# EAGLE design Shawn'sNano (EAGLE 8.7.1)
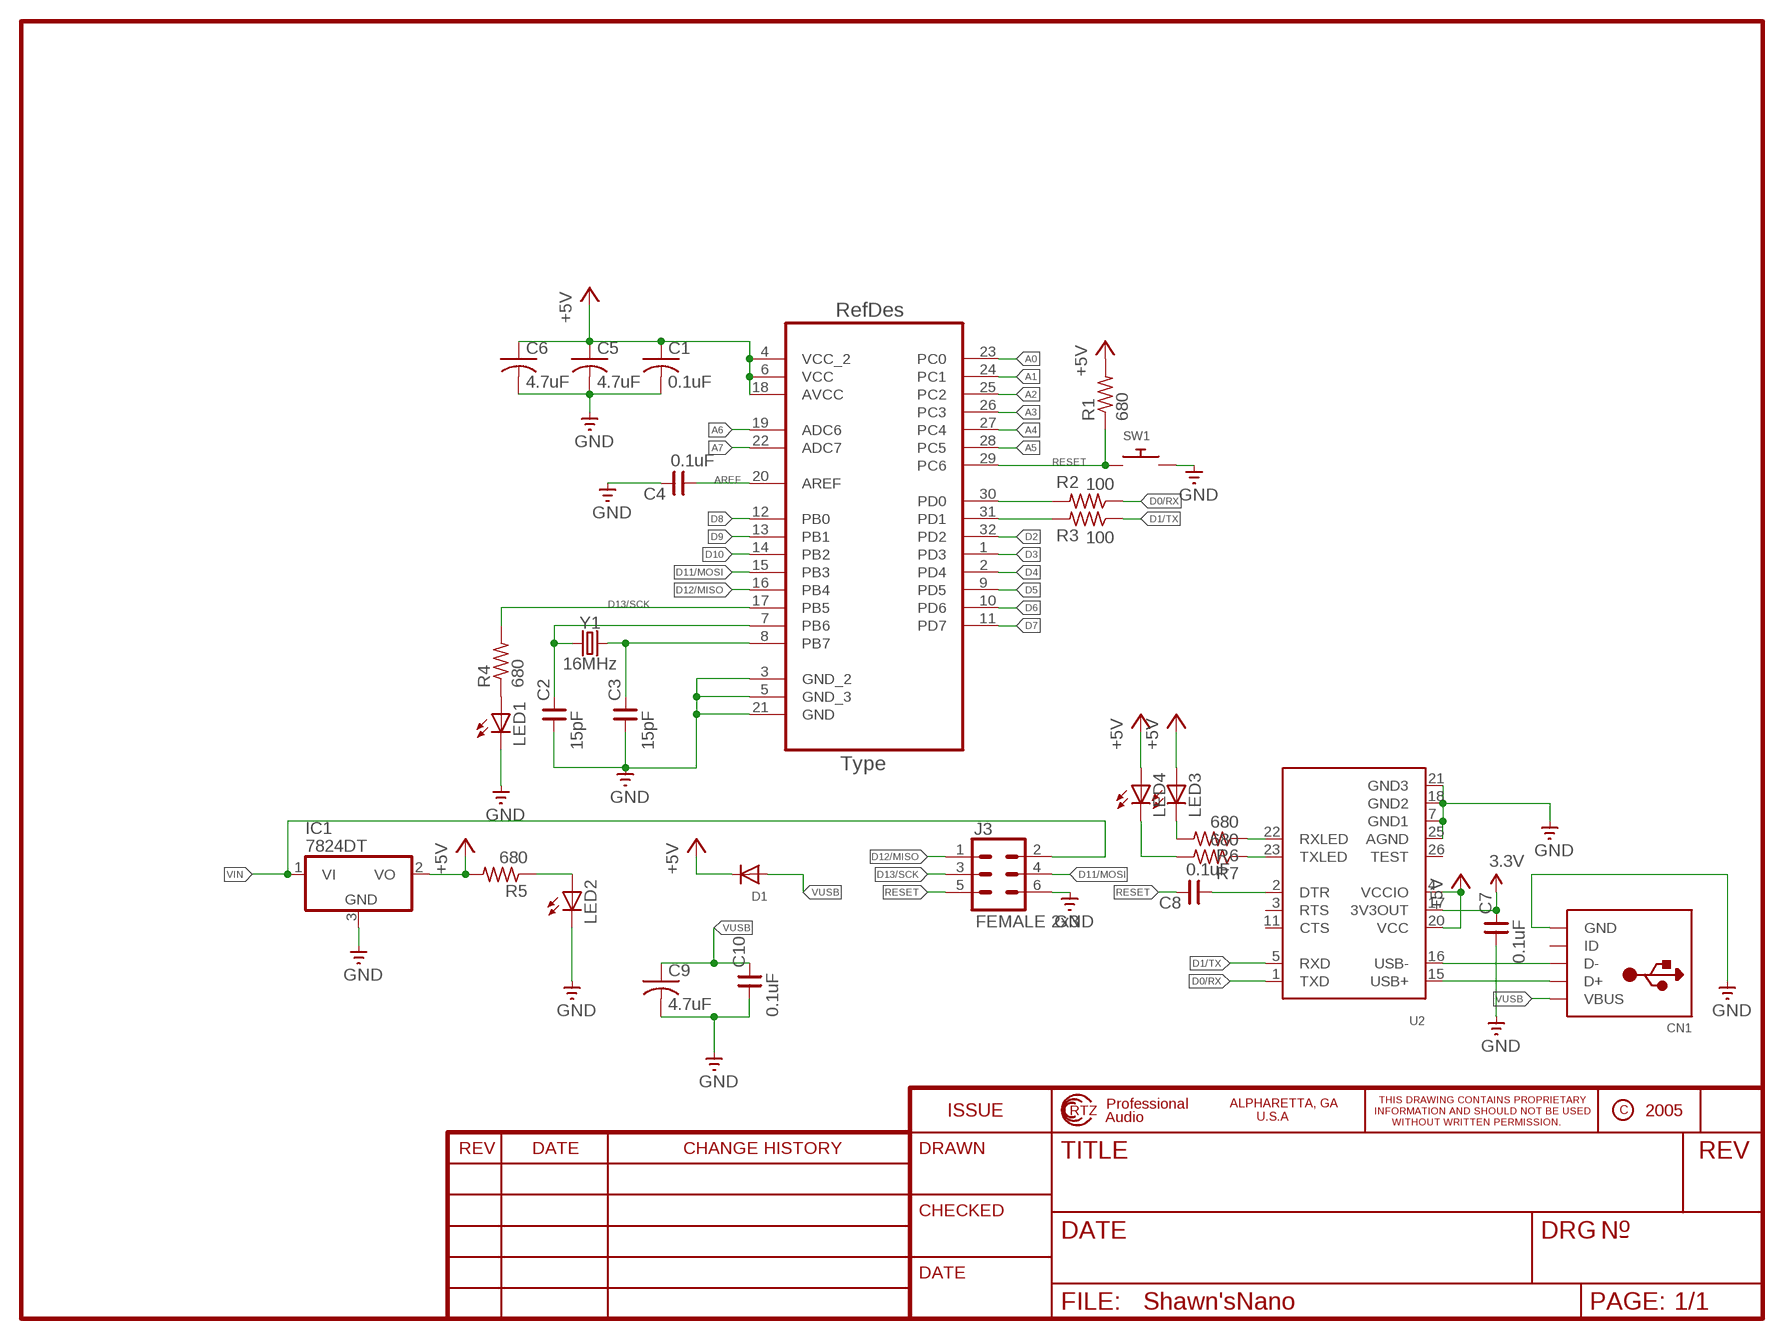
[diagram p0: schematic, sheet 1]

## Parts
C1  0.1uF  C-USC0805  [C0805]
C2  15pF  CNP-0805  [0805]
C3  15pF  CNP-0805  [0805]
C4  0.1uF  CNP-0805  [0805]
C5  4.7uF  C-USC0805  [C0805]
C6  4.7uF  C-USC0805  [C0805]
C7  0.1uF  CNP-0805  [0805]
C8  0.1uF  CNP-0805  [0805]
C9  4.7uF  C-USC0805  [C0805]
C10  0.1uF  CNP-0805  [0805]
CN1  USBMINIB  [USB-MINIB]
D1  DIODESOD-123  [SOD-123]
IC1  7824DT  [TO252]
J3  FEMALE 2x3  CONN_03X2FEMALE  [2X3]
LED1  LEDCHIPLED_0805  [CHIPLED_0805]
LED2  LEDCHIPLED_0805  [CHIPLED_0805]
LED3  LEDCHIPLED_0805  [CHIPLED_0805]
LED4  LEDCHIPLED_0805  [CHIPLED_0805]
R1  680  R-US_R0805  [R0805]
R2  100  R-US_R0805  [R0805]
R3  100  R-US_R0805  [R0805]
R4  680  R-US_R0805  [R0805]
R5  680  R-US_R0805  [R0805]
R6  680  R-US_R0805  [R0805]
R7  680  R-US_R0805  [R0805]
SW1  SWITCH_PUSHBUTTONEVQ-PE  [TACT_PANA-EVQ]
U1  ATMEGA328P-AU  [QFP80P900X900X120-32N]
U2  FT232RLSSOP28  [SSOP28DB]
Y1  16MHz  CRYSTAL-16MHZPTH-HC49US  [HC49US]

## Nets
3.3V: C7.2 U2.17(3V3OUT)
+5V: C1.1 C5.1 C6.1 D1.C IC1.2(VO) LED3.A LED4.A R1.2 R5.2 U1.4(VCC_2) U1.6(VCC) U1.18(AVCC) U2.4(VCCIO) U2.20(VCC)
A0: U1.23(PC0)
A1: U1.24(PC1)
A2: U1.25(PC2)
A3: U1.26(PC3)
A4: U1.27(PC4)
A5: U1.28(PC5)
A6: U1.19(ADC6)
A7: U1.22(ADC7)
AREF: C4.1 U1.20(AREF)
D0/RX: R2.1 U2.1(TXD)
D1/TX: R3.1 U2.5(RXD)
D2: U1.32(PD2)
D3: U1.1(PD3)
D4: U1.2(PD4)
D5: U1.9(PD5)
D6: U1.10(PD6)
D7: U1.11(PD7)
D8: U1.12(PB0)
D9: U1.13(PB1)
D10: U1.14(PB2)
D11/MOSI: J3.4 U1.15(PB3)
D12/MISO: J3.1 U1.16(PB4)
D13/SCK: J3.3 R4.2 U1.17(PB5)
GND: C1.2 C2.1 C3.1 C4.2 C5.2 C6.2 C7.1 C9.2 C10.1 CN1.GND IC1.3(GND) J3.6 LED1.C LED2.C SW1.P$2 U1.3(GND_2) U1.5(GND_3) U1.21(GND) U2.7(GND1) U2.18(GND2) U2.21(GND3) U2.25(AGND)
N$1: C3.2 U1.8(PB7) Y1.2
N$2: C2.2 U1.7(PB6) Y1.1
N$3: LED1.A R4.1
N$4: LED2.A R5.1
N$5: CN1.D+ U2.15(USB+)
N$6: CN1.D- U2.16(USB-)
N$7: R2.2 U1.30(PD0)
N$8: R3.2 U1.31(PD1)
N$9: LED3.C R6.2
N$12: R6.1 U2.22(RXLED)
N$13: R7.1 U2.23(TXLED)
N$14: C8.1 U2.2(DTR)
N$15: LED4.C R7.2
RESET: C8.2 J3.5 R1.1 SW1.P$1 U1.29(PC6)
VIN: IC1.1(VI) J3.2
VUSB: C9.1 C10.2 CN1.VBUS D1.A
Unconnected: CN1.ID U2.3(RTS) U2.11(CTS) U2.26(TEST)

## Library data of the parts
C1 C5 C6 C9 = adafruit:C-US: CAPACITOR, American symbol
C2-C4 C7 C8 C10 = cap-master:CNP-: NON-POLARIZED CAP
CN1 = adafruit:USB: USB Connectors USBMINIB - Surface Mount Female Mini-B USB Connector 4UConnector: 06564 By microbuilder.eu Thru-hole RA Female Mini-B USB Connector 4UConnector: 18732 By ladyada.net
D1 = adafruit:DIODE: Diode SMADIODE - SMA Surface Mount Package 20V 1A Schottky Diode Digikey: 641-1014-6-ND DO-1N4148 - Through Hole Small Current Diode SOD-123 20V 1 A (.5mV Vf) Schottky Diode - Digikey: MBRX120TPMSCT-ND SOD-323 10V 570mA (.38mV Vf, 3ns) Schottky Diode - Digikey: ZLLS410CT-ND SOD-523 30V 30mA Schottky Diode (RB751S-40TE61) - Digikey: RB751S-40TE61CT-ND SOT23-R/W - SOT23 Package (R = Solder Paste/Reflow Ovens, W = Hand-Soldering) BAT54Film 40V 300mA - Digikey: 497-7162-1-ND
IC1 = adafruit:78*: Positive VOLTAGE REGULATOR Added bigger pads to the TO-92 package
J3 = SparkFun-Connectors:CONN_03X2: Multi connection point. Often used as Generic Header-pin footprint for 0.1 inch spaced/style header connections You can populate with any combo of single row headers, but if you'd like an exact match, check these: Header - 2x3 (Male, 0.1") <https://www.sparkfun.com/products/12807> (PRT-12807) Header - 2x3 (Female, 0.1") <https://www.sparkfun.com/products/13010> (PRT-13010) 2x3 Pin Shrouded Header <https://www.sparkfun.com/products/10877> (PRT-10877) On any of the 0.1 inch spaced packages, you can populate with these: Break Away Headers - Straight <https://www.sparkfun.com/products/116> (PRT-00116) Break Away Male Headers - Right Angle <https://www.sparkfun.com/products/553> (PRT-00553) Female Headers <https://www.sparkfun.com/products/115> (PRT-00115) Break Away Headers - Machine Pin <https://www.sparkfun.com/products/117> (PRT-00117) Break Away Female Headers - Swiss Machine Pin <https://www.sparkfun.com/products/743> (PRT-00743) Special note: the shrouded connector mates well with our 3x2 ribbon cables: Ribbon Crimp Connector - 6-pin (2x3, Female) <https://www.sparkfun.com/products/10651> (PRT-10651) Ribbon Cable - 6 wire (15ft) <https://www.sparkfun.com/products/10646> (PRT-10646); PROD_ID: CONN-11566
LED1-LED4 = adafruit:LED: LED OSRAM: - CHIPLED LG R971, LG N971, LY N971, LG Q971, LY Q971, LO R971, LY R971 LH N974, LH R974 LS Q976, LO Q976, LY Q976 LO Q996 - Hyper CHIPLED LW Q18S LB Q993, LB Q99A, LB R99A - SideLED LS A670, LO A670, LY A670, LG A670, LP A670 LB A673, LV A673, LT A673, LW A673 LH A674 LY A675 LS A676, LA A676, LO A676, LY A676, LW A676 LS A679, LY A679, LG A679 - Hyper Micro SIDELED® LS Y876, LA Y876, LO Y876, LY Y876 LT Y87S - SmartLED LW L88C, LW L88S LB L89C, LB L89S, LG L890 LS L89K, LO L89K, LY L89K LS L896, LA L896, LO L896, LY L896 - TOPLED LS T670, LO T670, LY T670, LG T670, LP T670 LSG T670, LSP T670, LSY T670, LOP T670, LYG T670 LG T671, LOG T671, LSG T671 LB T673, LV T673, LT T673, LW T673 LH T674 LS T676, LA T676, LO T676, LY T676, LB T676, LH T676, LSB T676, LW T676 LB T67C, LV T67C, LT T67C, LS T67K, LO T67K, LY T67K, LW E67C LS E67B, LA E67B, LO E67B, LY E67B, LB E67C, LV E67C, LT E67C LW T67C LS T679, LY T679, LG T679 LS T770, LO T770, LY T770, LG T770, LP T770 LB T773, LV T773, LT T773, LW T773 LH T774 LS E675, LA E675, LY E675, LS T675 LS T776, LA T776, LO T776, LY T776, LB T776 LHGB T686 LT T68C, LB T68C - Hyper Mini TOPLED® LB M676 - Mini TOPLED Santana® LG M470 LS M47K, LO M47K, LY M47K Source: http://www.osram.convergy.de/
R1-R7 = adafruit:R-US_: RESISTOR, American symbol
SW1 = adafruit:SWITCH_PUSHBUTTON: Buttons SOFTTOUCHSMD_SJ - Soft touch temporary push button (Super Junk Akihabara) Compatible with SKPMANE010 [Mouser: 688-SKPMAN] C&K_KSS = Digikey: KSS221GLFS
U1 = Atmel-ATMEGA328P-AU:ATMEGA328P-AU; DESCRIPTION: 8-bit Microcontroller with In-System Programmable Flash; MPN: ATMEGA328P-AU; OC_FARNELL: 1715486; OC_NEWARK: 14R4631; PACKAGE: TQFP-32; SUPPLIER: Atmel
U2 = microbuilder:FT232RL: FTDI FT232RL USB TO RS232 Converter Digikey: 768-1007-1-ND
Y1 = SparkFun-Clocks:CRYSTAL-16MHZ: 16MHz Crystal Digikey Example <http://www.digikey.com/product-search/en?keywords=535-9122-1-ND> Frequency: 16MHz Frequency Stability: ±50ppm Frequency Tolerance: ±20ppm Load Capacitance: 18pF SparkFun Products: Pro Micro -5V/16MHz <https://www.sparkfun.com/products/12640> SparkFun Serial Enabled LCD Kit <https://www.sparkfun.com/products/10097>; PROD_ID: XTAL-08181; SF_ID: COM-00536

## Board
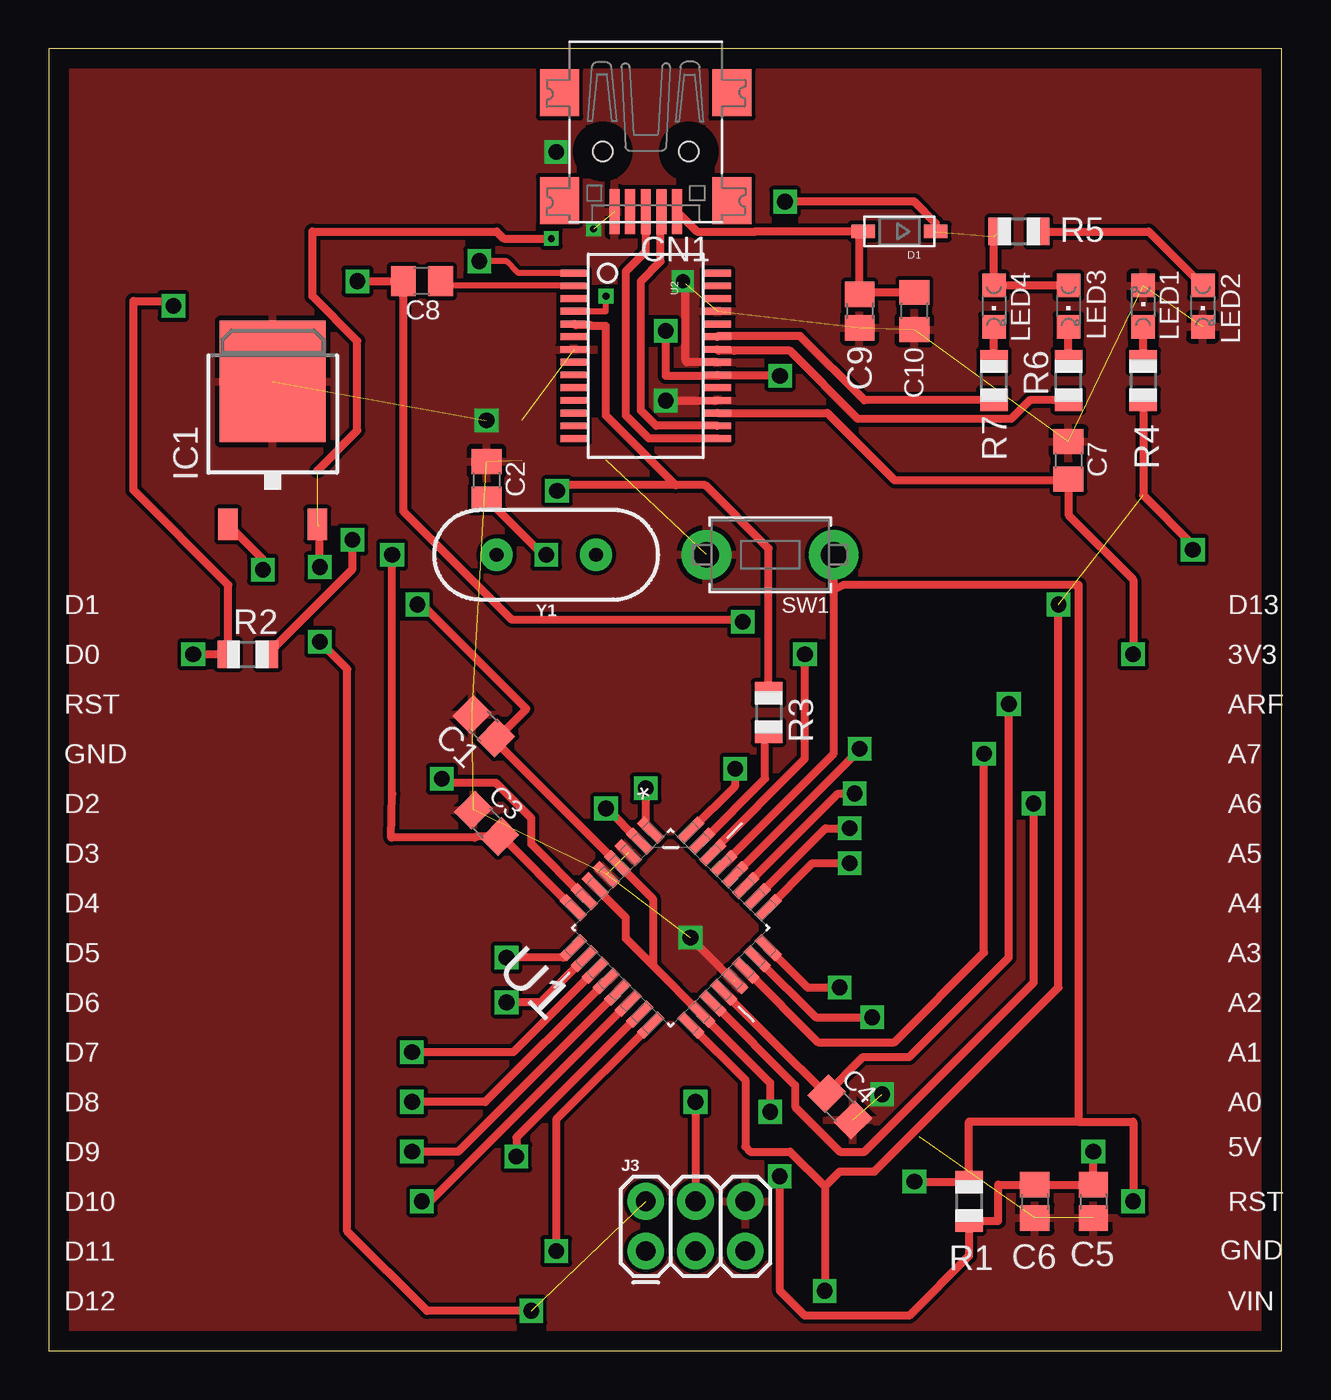
[diagram p1: board, top side]
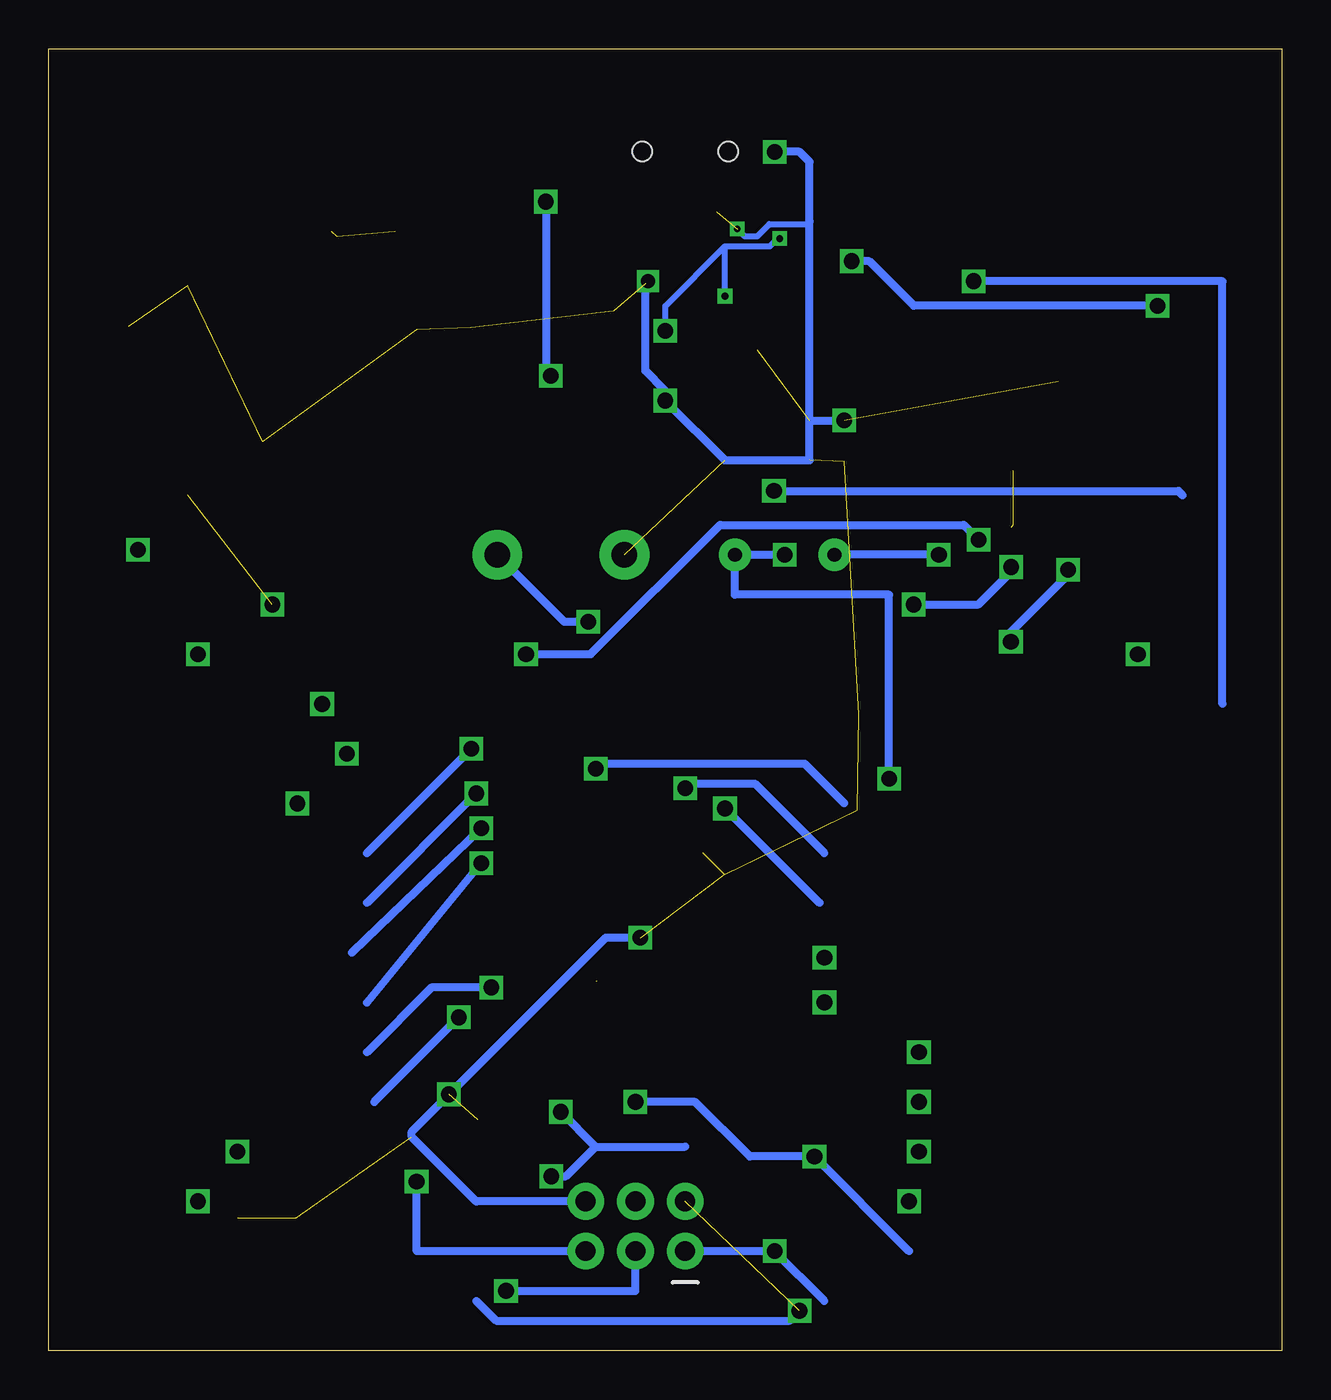
[diagram p2: board, bottom side, seen from below]

Size 62.97 x 66.47 mm. Coordinates in mm from the lower left corner, seen from the top.
Outline: 0,0 62.97,0 62.97,66.47 0,66.47 0,0
Copper layers (1*16): Top 0.035mm / dielectric 1.5mm / Bottom 0.035mm
Design rules "default": minimum track width 10mil, minimum drill 24mil, track to track 8mil, track to pad 8mil, pad to pad 8mil, via to via 8mil, smd to smd 8mil, copper to edge 40mil, drill to drill 8mil, minimum pad ring 10mil, minimum via ring 8mil, stop-mask expansion 4mil, vias tented up to drill 0mil, thermal gap 10mil

### Footprints (pad centres in the part's own frame; a part is rotated, then mirrored left to right if it is on the bottom)
C0805 = smd 1.3 x 1.5: 1 -0.85,0; 2 0.85,0
0805 = smd 1.27 x 1.524: 1 -0.953,0; 2 0.953,0
USB-MINIB = smd 0.5 x 2.308: D+ 0,4.064; D- -0.8,4.064; GND 1.6,4.064; ID 0.8,4.064; VBUS -1.6,4.064 | smd 2 x 2.4: GND1 -4.4,-2; GND2 -4.4,3.5; GND3 4.4,3.5; GND4 4.4,-2 | hole 1: -2.2,1; 2.2,1
SOD-123 = smd 1.2 x 0.7: A 1.85,0; C -1.85,0
TO252 = smd 1 x 1.6: 1 -2.28,-4.8; 2 2.28,-4.8 | smd 5.4 x 6.2: 3 0,2.5
2X3 = drill 1.016 pad 1.88: 1 0,0; 2 0,2.54; 3 2.54,0; 4 2.54,2.54; 5 5.08,0; 6 5.08,2.54
CHIPLED_0805 = smd 1.2 x 1.2: A 0,-1.05; C 0,1.05
R0805 = smd 1.1 x 1.4: 1 -1,0; 2 1,0
TACT_PANA-EVQ = drill 1.3 pad 2.54: P$1 -3.25,0; P$2 3.25,0
QFP80P900X900X120-32N = smd 1.473 x 0.508: 1 -4.242,2.794; 2 -4.242,2.007; 3 -4.242,1.194; 4 -4.242,0.406; 5 -4.242,-0.406; 6 -4.242,-1.194; 7 -4.242,-2.007; 8 -4.242,-2.794; 17 4.242,-2.794; 18 4.242,-2.007; 19 4.242,-1.194; 20 4.242,-0.406; 21 4.242,0.406; 22 4.242,1.194; 23 4.242,2.007; 24 4.242,2.794 | smd 0.508 x 1.473: 9 -2.794,-4.242; 10 -2.007,-4.242; 11 -1.194,-4.242; 12 -0.406,-4.242; 13 0.406,-4.242; 14 1.194,-4.242; 15 2.007,-4.242; 16 2.794,-4.242; 25 2.794,4.242; 26 2.007,4.242; 27 1.194,4.242; 28 0.406,4.242; 29 -0.406,4.242; 30 -1.194,4.242; 31 -2.007,4.242; 32 -2.794,4.242
SSOP28DB = smd 0.348 x 1.397: 1 -4.225,-3.656; 2 -3.575,-3.656; 3 -2.925,-3.656; 4 -2.275,-3.656; 5 -1.625,-3.656; 6 -0.975,-3.656; 7 -0.325,-3.656; 8 0.325,-3.656; 9 0.975,-3.656; 10 1.625,-3.656; 11 2.275,-3.656; 12 2.925,-3.656; 13 3.575,-3.656; 14 4.225,-3.656; 15 4.225,3.656; 16 3.575,3.656; 17 2.925,3.656; 18 2.275,3.656; 19 1.625,3.656; 20 0.975,3.656; 21 0.325,3.656; 22 -0.325,3.656; 23 -0.975,3.656; 24 -1.625,3.656; 25 -2.275,3.656; 26 -2.925,3.656; 27 -3.575,3.656; 28 -4.225,3.656
HC49US = drill 0.7 pad 1.651: 1 -2.54,0; 2 2.54,0

### Placement (x,y rotation side)
C1  22.22,31.89 135 top
C2  22.35,44.45 270 top
C3  22.35,26.92 315 top
C4  40.39,12.45 315 top
C5  53.34,7.62 270 top
C6  50.34,7.62 270 top
C7  52.07,45.47 270 top
C8  19.05,54.61 180 top
C9  41.4,53.09 270 top
C10  44.2,53.09 90 top
CN1  30.48,62.23 180 top
D1  43.43,57.15 180 top
IC1  11.43,46.99 0 top
J3  30.48,5.08 0 top
LED1  55.88,53.34 0 top
LED2  58.93,53.34 180 top
LED3  52.07,53.34 180 top
LED4  48.26,53.34 180 top
R1  46.99,7.62 270 top
R2  10.16,35.56 0 top
R3  36.76,32.59 270 top
R4  55.88,49.53 270 top
R5  49.53,57.15 180 top
R6  52.07,49.53 90 top
R7  48.26,49.53 90 top
SW1  36.83,40.64 180 top
U1  31.75,21.59 315 top
U2  30.48,50.8 270 top
Y1  25.4,40.64 180 top

### Tracks (layer width: path | path; a pad name or v marks a point on that pad's centre or on a via)
3.3V  (via drill 0.8)
  Top 0.406: U2.17 39.76,47.87 43.18,44.45 52.01,44.45 C7.2 52.07,42.67 55.37,39.37 v55.37,35.56
+5V  (via drill 0.35, 0.8)  (4 unrouted)
  Top 0.305: U2.4 28.44,53.07 28.45,53.09 v28.45,53.85
  Top 0.406: 30.84,19.66 U1.18 36.83,13.67 v36.83,12.19 | 30.84,19.66 29.46,21.04 29.46,22.1 27.91,23.66 U1.6 | 30.84,19.66 30.84,23.08 U1.4 22.82,31.1 C1.1 22.9,31.28 24.38,32.77 19.05,38.1 v18.81,38.1 | v53.34,10.16 C5.1 C6.1 48.48,8.47 48.48,6.62 R1.2 | 47.01,6.6 R1.2 | R1.2 46.72,6.35 | R1.2 46.99,4.83 43.94,1.78 38.61,1.78 37.34,3.05 37.34,8.91 v37.32,8.9 | v13.83,40.01 13.83,42.07 | LED3.A LED4.A 48.26,56.88 | D1.C 45.28,57.59 44.2,58.67 v37.59,58.67 | v37.34,49.78 34.18,49.78 U2.20 34.1,49.78 31.5,49.78 v31.5,52.07 | 13.71,44.95 15.75,46.99 15.75,51.56 13.46,53.85 13.46,57.15 22.86,57.15 23.22,56.79 v25.65,56.79
  Bottom 0.305: v31.5,52.07 31.5,53.34 28.45,56.39 | 28.45,56.39 26.16,56.39 25.76,56.79 v25.65,56.79 | v28.45,53.85 28.45,56.39
  Bottom 0.406: 35.05,10.41 v36.83,12.19 | 35.05,10.41 30.48,10.41 | v37.32,8.9 36.57,8.9 35.05,10.41 | v18.81,38.1 15.49,38.1 13.72,39.88 13.72,39.9 v13.83,40.01 | v37.59,58.67 37.59,49.78 v37.34,49.78
A0  (via drill 0.8)
  Top 0.406: U1.23 39.16,17.02 v42.05,17.02 42.16,17.02
  Bottom 0.406: v42.05,17.02 46.36,12.7
A1  (via drill 0.8)
  Top 0.406: U1.24 38.75,18.54 v40.39,18.54
  Bottom 0.406: v40.39,18.54 43.43,18.54 46.74,15.24
A2  (via drill 0.8)
  Top 0.406: U1.25 39,24.89 v40.89,24.89
  Bottom 0.406: v40.89,24.89 46.74,17.78
A3  (via drill 0.8)
  Top 0.406: U1.26 39.67,26.67 v40.89,26.67
  Bottom 0.406: v40.89,26.67 47.5,20.32
A4  (via drill 0.8)
  Top 0.406: U1.27 40.3,28.45 v41.15,28.45
  Bottom 0.406: v41.15,28.45 46.74,22.86
A5  (via drill 0.8)
  Top 0.406: U1.28 41.4,30.67 v41.4,30.73
  Bottom 0.406: v41.4,30.73 46.74,25.4
A6  (via drill 0.8)
  Top 0.406: U1.19 38.1,13.55 38.1,12.45 40.39,10.16 41.66,10.16 50.29,18.8 50.29,27.94 v50.28,27.94
A7  (via drill 0.8)
  Top 0.406: U1.22 39.28,15.75 43.18,15.75 47.75,20.32 v47.75,30.48
AREF  (via drill 0.8)
  Top 0.406: U1.20 37.87,14.9 C4.1 41.58,14.99 43.94,14.99 49.02,20.07 v49.02,33.02
D0/RX  (via drill 0.8)
  Top 0.305: U2.1 23.97,55.02 23.36,55.63 v21.98,55.63
  Top 0.406: v7.37,35.56 R2.1 9.16,39.1 4.32,43.94 4.32,53.59 6.11,53.59 v6.35,53.35
  Bottom 0.406: v6.35,53.35 18.81,53.35 21.08,55.63 v21.97,55.63 v21.98,55.63
D1/TX  (via drill 0.8)
  Top 0.406: R3.1 36.76,40.97 33.53,44.2 32,44.2 | 32,44.2 28.45,47.75 28.45,52.32 27.72,52.32 27.69,52.36 26.89,52.36 U2.5 | v25.95,43.9 26.25,44.2 32,44.2
  Bottom 0.406: v25.95,43.9 5.29,43.9 5.08,43.69
D2  (via drill 0.8)
  Top 0.406: U1.32 35.05,28.84 v35.05,29.72
  Bottom 0.406: v35.05,29.72 34.8,29.97 24.38,29.97 22.35,27.94
D3  (via drill 0.8)
  Top 0.406: U1.1 30.48,26.81 v30.48,28.71
  Bottom 0.406: v30.48,28.71 30.24,28.96 26.92,28.96 23.37,25.4
D4  (via drill 0.8)
  Top 0.406: U1.2 28.49,27.69 v28.45,27.69
  Bottom 0.406: v28.45,27.69 23.62,22.86
D5  (via drill 0.8)
  Top 0.406: U1.9 26.27,20.07 v23.37,20.07
  Bottom 0.406: v23.37,20.07 23.11,20.32
D6  (via drill 0.8)
  Top 0.406: U1.10 25.1,17.78 v23.37,17.78
D7  (via drill 0.8)
  Top 0.406: U1.11 23.71,15.24 v18.54,15.24
D8  (via drill 0.8)
  Top 0.406: U1.12 22.29,12.7 v18.54,12.7
D9  (via drill 0.8)
  Top 0.406: U1.13 20.89,10.16 v18.54,10.16
D10  (via drill 0.8)
  Top 0.406: U1.14 19.47,7.62 v19.05,7.62
D11/MOSI  (via drill 0.8)
  Top 0.406: U1.15 23.88,10.88 v23.88,9.91 | v33.02,12.7 J3.4
  Bottom 0.406: v33.02,12.7 29.97,12.7 27.18,9.91 v23.88,9.91 19.05,5.08
D12/MISO  (via drill 0.8)
  Top 0.406: U1.16 25.91,11.8 v25.91,5.08
  Bottom 0.406: J3.1 v25.91,5.08 23.37,2.54
D13/SCK  (via drill 0.8)  (1 unrouted)
  Top 0.406: U1.17 35.56,13.83 35.56,10.41 35.81,10.16 37.85,10.16 39.62,8.38 | 39.62,8.38 v39.62,3.05 | 39.62,8.38 40.39,9.14 42.16,9.14 51.56,18.54 v51.56,38.1 | R4.2 55.88,43.69 58.42,41.15 v58.42,40.89
  Bottom 0.406: v39.62,3.05 33.02,3.05 J3.3
GND  (via drill 0.35 pad 0.55, 0.7, 0.8)  (20 unrouted)
  Top 0.406: 34.97,18.88 v32.77,21.08 | U2.21 32.58,50.47 32.51,50.55 32.51,54.48 v32.38,54.61 | v31.5,48.52 34.13,48.52 U2.18
  Bottom 0.305: v27.82,57.28 27.44,56.9 26.81,56.9 26.18,57.53 24.26,57.53 24.13,57.66
  Bottom 0.406: J3.6 41.15,7.62 44.45,10.92 44.45,11.18 v42.55,13.08 | v42.55,13.08 42.42,13.21 | v32.77,21.08 34.54,21.08 v42.55,13.08 | v31.5,48.51 v31.5,48.52 | 24.13,47.5 24.13,57.66 24.13,60.71 24.64,61.21 v25.91,61.21 26.16,61.21 | 24.13,47.5 v22.35,47.5 | v31.5,48.52 31.5,49.02 32.51,50.04 32.51,54.48 v32.38,54.61 | v31.5,48.52 28.45,45.47 24.13,45.47 24.13,47.5
  pour Top: 0,0 0,66.29 62.99,66.55 62.99,0
N$1  (via drill 0.8)
  Top 0.406: U1.8 23.14,26.25 C3.2 21.8,26.25 21.76,26.2 17.48,26.2 17.53,28.45 v17.53,40.64
  Bottom 0.406: v17.53,40.64 Y1.2
N$2  (via drill 0.8)
  Top 0.406: U1.7 24.64,25.86 24.64,27.18 22.82,28.99 20.27,28.99 v20.07,29.2 | C2.2 25.21,40.64 v25.4,40.64
  Bottom 0.406: v20.07,29.2 20.07,38.61 27.94,38.61 Y1.1 v25.4,40.64
N$3
  Top 0.406: R4.1 LED1.A
N$4
  Top 0.406: R5.1 56.17,57.15 LED2.A
N$5
  Top 0.406: U2.15 30.64,46.57 29.46,47.75 29.46,55.12 30.48,56.13 CN1.D+
N$6
  Top 0.406: U2.16 31.01,47.22 30.23,48.01 30.23,54.61 31.24,55.63 31.24,58.13 CN1.D-
N$7  (via drill 0.8)
  Top 0.406: U1.30 33.91,25.52 38.61,30.23 v38.61,35.56 | v15.49,41.4 15.49,39.89 R2.2
  Bottom 0.406: v38.61,35.56 35.31,35.56 28.7,42.16 16.26,42.16 v15.49,41.4
N$8
  Top 0.406: U1.31 33.37,26.01 36.58,29.21 36.58,31.41 R3.2
N$9
  Top 0.406: R6.2 LED3.C
N$12
  Top 0.406: R6.1 50.08,48.53 49.13,47.57 41.33,47.57 37.85,51.05 35,51.05 35,51.06 34.21,51.06 U2.22
N$13
  Top 0.406: R7.1 41.64,48.53 38.35,51.82 34.18,51.82 U2.23
N$14
  Top 0.305: U2.2 20.24,54.37 C8.1
  Top 0.406: 20,54.37 C8.1
N$15
  Top 0.406: R7.2 LED4.C
RESET  (via drill 0.8)
  Top 0.406: U1.29 40.08,30.49 40.08,38.86 | 40.08,38.86 SW1.P$1 | v44.2,8.64 44.21,8.62 R1.1 46.99,11.68 52.58,11.68 | 52.58,11.68 55.37,11.68 v55.37,7.62 | 40.08,38.86 40.59,39.12 52.58,39.12 52.58,11.68 | v15.75,54.61 C8.2 18.1,42.86 23.62,37.34 35.31,37.34 v35.43,37.21
  Bottom 0.406: J3.5 44.2,5.08 v44.2,8.64 | 3.05,33.02 3.05,54.61 v15.75,54.61 | v35.43,37.21 36.65,37.21 SW1.P$1
VIN  (via drill 0.8)  (1 unrouted)
  Top 0.406: v24.64,2.03 19.31,2.03 15.24,6.1 15.24,34.8 v13.84,36.19 13.72,36.32 | v10.92,39.88 10.92,40.42 IC1.1
  Bottom 0.406: 41.15,2.54 40.13,1.52 25.15,1.52 v24.64,2.03 | v13.84,36.19 13.84,36.7 10.92,39.62 v10.92,39.88
VUSB
  Top 0.406: C10.2 41.5,54.04 C9.1 41.4,56.97 D1.A 36.07,57.15 36.05,57.12 33.12,57.12 CN1.VBUS

### Text on the board
tOrigins: IronBoard Rev A | Shawn Victor
tNames: D1 | D13 | D0 | 3V3 | RST | ARF | GND | A7 | D2 | A6 | D3 | A5 | D4 | A4 | D5 | A3 | D6 | A2 | D7 | A1 | D8 | A0 | D9 | 5V | D10 | RST | D11 | GND | D12 | VIN